# EasyEDA schematic SCH_aqMood_2025-03-14.json
TITLE: aqMood; REV: 1.1; Date: 2025-03-14; Sheet: 1/1; Drawn By: tobi.stanzel; Company: Tobi
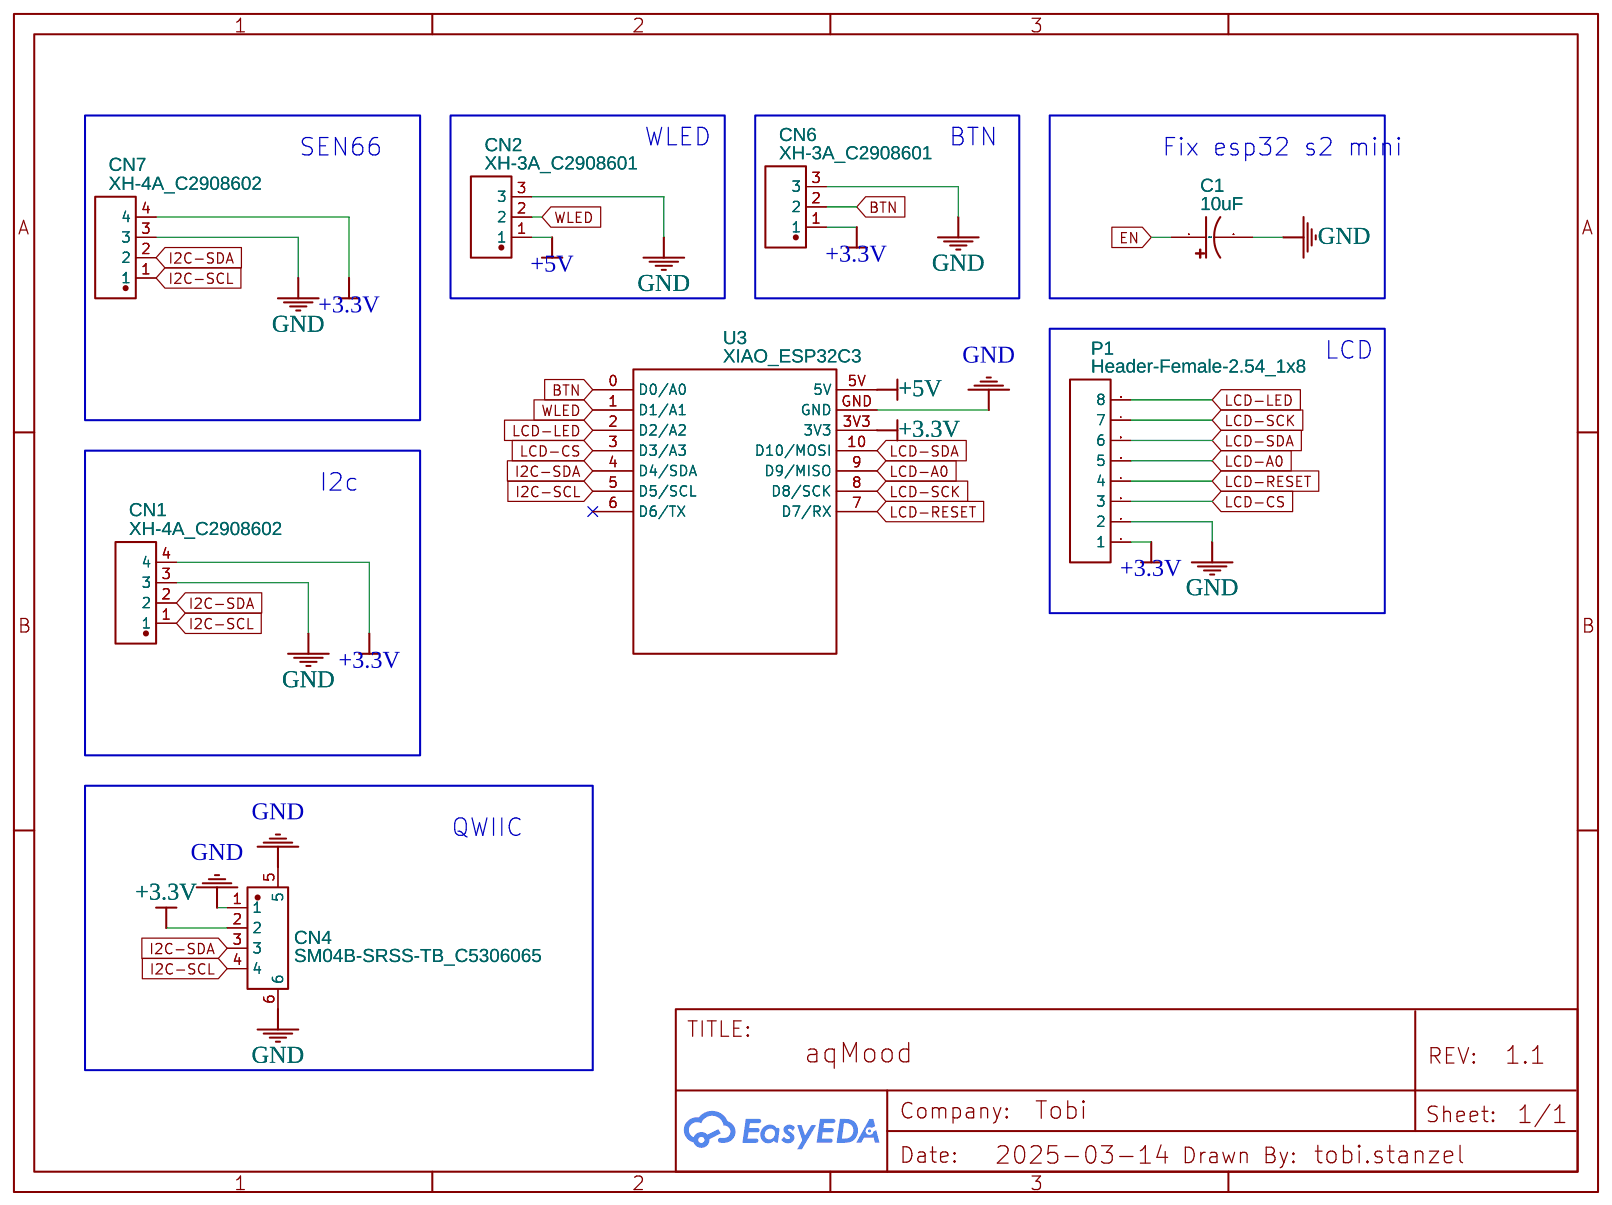
[diagram p0: schematic sheet]

## Parts
C1  10uF  [CAP-TH_BD5.0-P2.00-D0.8-FD]
CN1  XH-4A_C2908602  [CONN-TH_XH2.50-4P]
CN2  XH-3A_C2908601  [CONN-TH_XH-3A]
CN4  SM04B-SRSS-TB_C5306065  [CONN-SMD_4P-P1.00_SM04B-SRSS-TB-LF-SN]
CN6  XH-3A_C2908601  [CONN-TH_XH-3A]
CN7  XH-4A_C2908602  [CONN-TH_XH2.50-4P]
P1  Header-Female-2.54_1x8  [HDR-TH_8P-P2.54-V-F-1]
U3  XIAO_ESP32C3  [XIAO-ESP32-C3]

## Library data of the parts
C1 = ECR1HGK100MFA050011: Contributor: LCSC; Supplier: LCSC; Supplier Part: C397096; Manufacturer: Jianghai(南通江海); JLCPCB Part Class: Extended Part
CN1 CN7 = XH-4A_C2908602: Contributor: LCSC; Supplier: LCSC; Supplier Part: C2908602; Manufacturer: HCTL(华灿天禄); Manufacturer Part: XH-4A; JLCPCB Part Class: Extended Part
CN2 CN6 = XH-3A_C2908601: Contributor: LCSC; Supplier: LCSC; Supplier Part: C2908601; Manufacturer: HCTL(华灿天禄); Manufacturer Part: XH-3A; JLCPCB Part Class: Extended Part
CN4 = SM04B-SRSS-TB_C5306065: Contributor: lcsc; Supplier: LCSC; Supplier Part: C5306065; Manufacturer: null; Manufacturer Part: SM04B-SRSS-TB
P1 = Header-Female-2.54_1x8: Supplier: LCSC; Manufacturer: BOOMELE(博穆精密); Manufacturer Part: 2.54-1*8P母环保; Supplier Part: C27438; JLCPCB Part Class: Extended Part
U3 = XIAO_ESP32C3: Manufacturer: SeeedStudio; Manufacturer Part: XIAO ESP32C3; Supplier Part: 1597-113991054-ND; Supplier: Digi-Key; link: https://wiki.seeedstudio.com/XIAO_ESP32C3_Getting_Started/; Contributor: OpenGreenEnergy

## Nets
+3.3V: CN1.4 CN4.2 CN6.1 CN7.4 P1.1 U3.3V3
+5V: CN2.1 U3.5V
GND: C1.2 CN1.3 CN2.3 CN4.1 CN4.5 CN4.6 CN6.3 CN7.3 P1.2 U3.GND
BTN: CN6.2 U3.0(D0/A0)
EN: C1.1
I2C-SCL: CN1.1 CN4.4 CN7.1 U3.5(D5/SCL)
I2C-SDA: CN1.2 CN4.3 CN7.2 U3.4(D4/SDA)
LCD-A0: P1.5 U3.9(D9/MISO)
LCD-CS: P1.3 U3.3(D3/A3)
LCD-LED: P1.8 U3.2(D2/A2)
LCD-RESET: P1.4 U3.7(D7/RX)
LCD-SCK: P1.7 U3.8(D8/SCK)
LCD-SDA: P1.6 U3.10(D10/MOSI)
WLED: CN2.2 U3.1(D1/A1)

Not connected (* = marked no-connect by the designer): U3 6(D6/TX)*

## Notes on the sheet
- SEN66
- WLED
- BTN
- Fix esp32 s2 mini
- LCD
- I2c
- QWIIC
